# Altium schematic sheet M2RB.SchDoc
size B
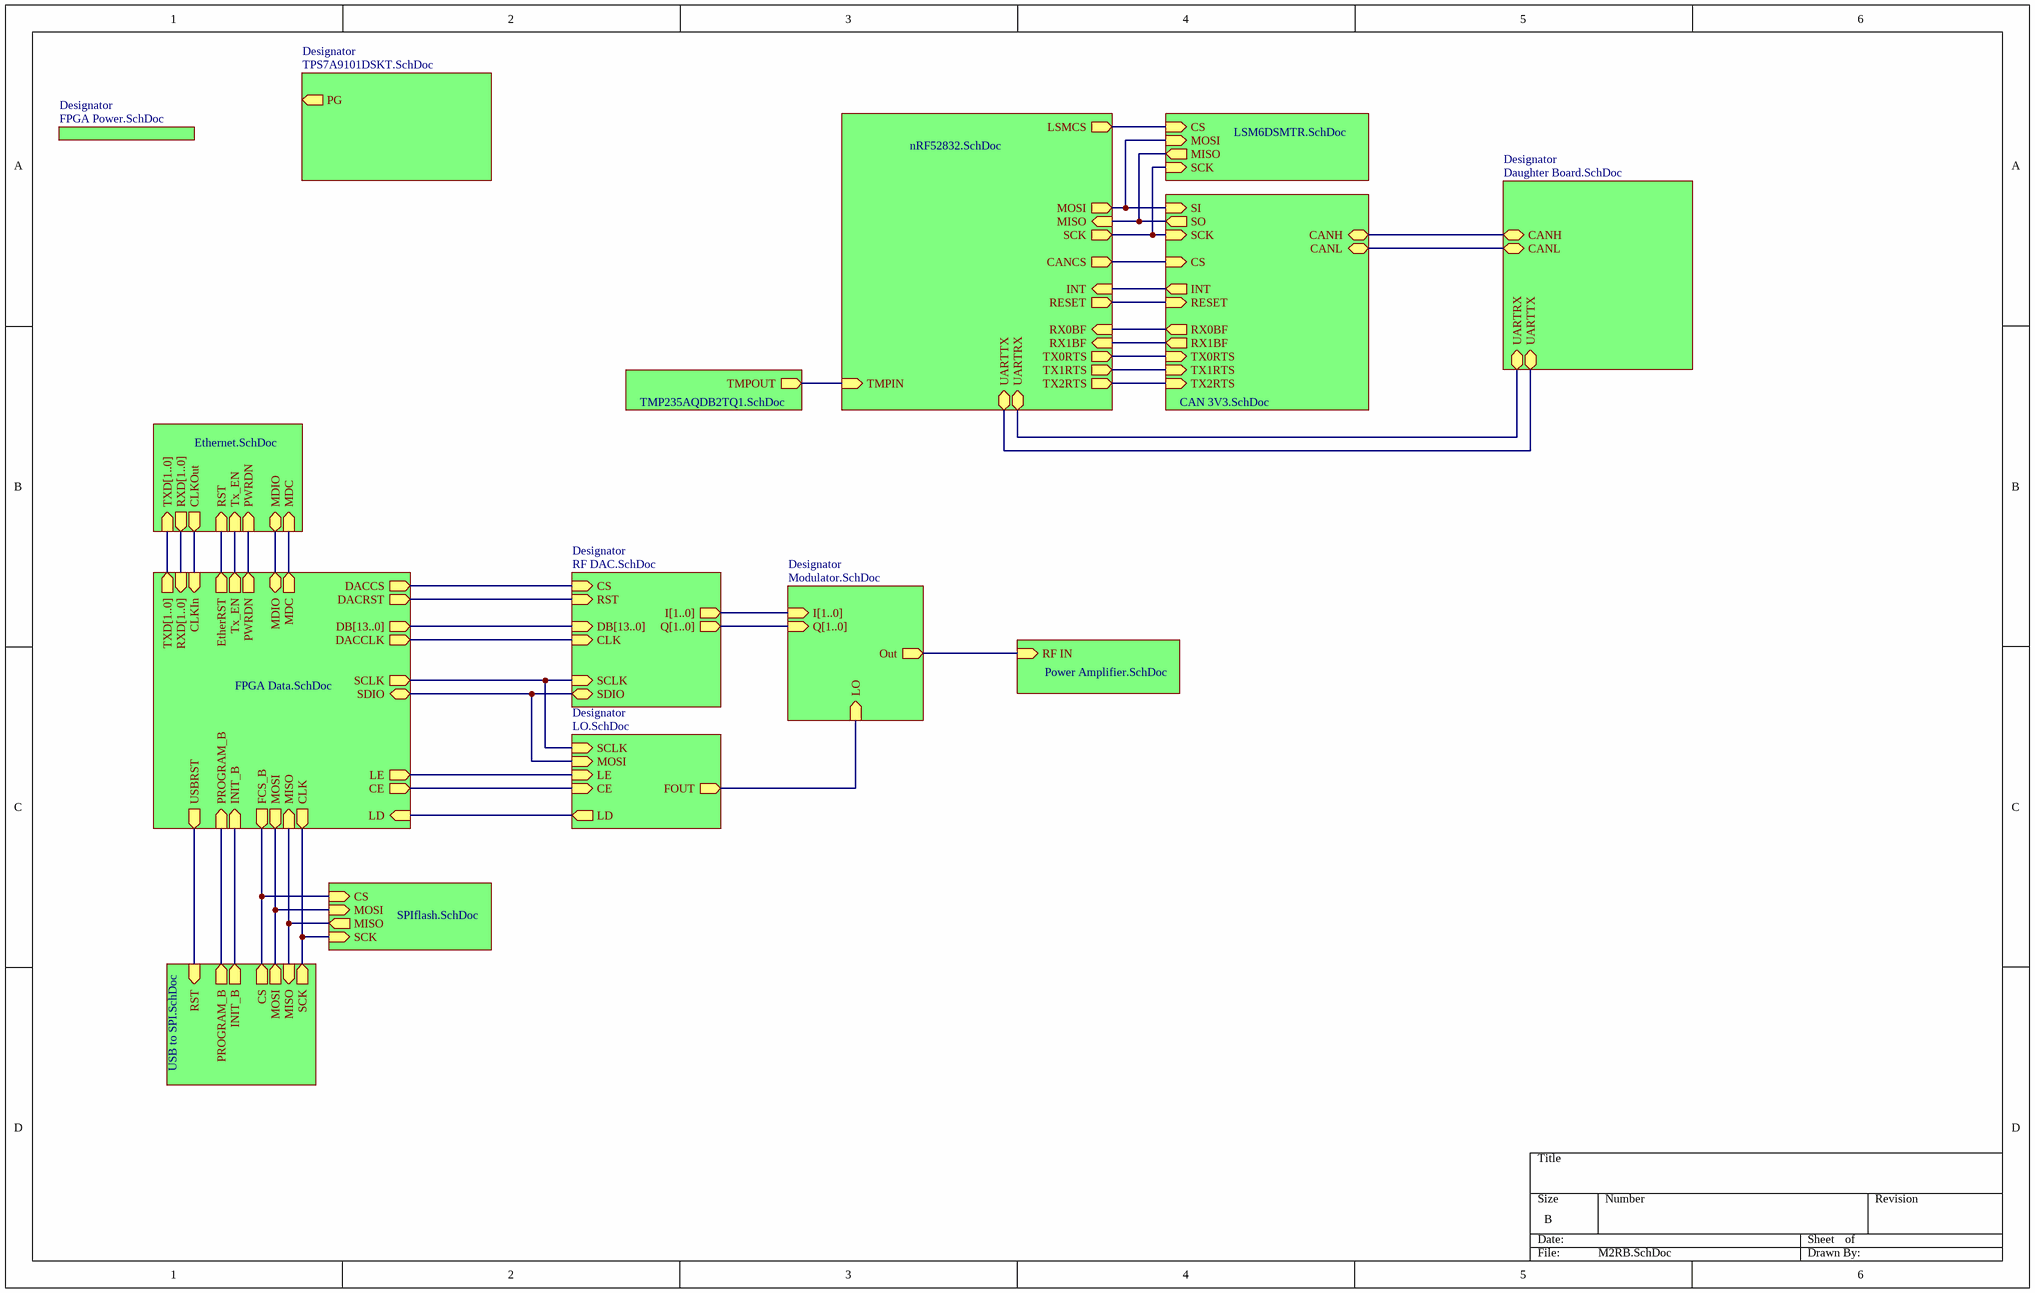
[diagram p0: M2RB.SchDoc]

## Sub-sheets
Designator = Power Amplifier.SchDoc: RF IN (in)
Designator = Daughter Board.SchDoc: UARTRX (bidir), UARTTX (bidir), CANL (bidir), CANH (bidir)
Designator = nRF52832.SchDoc: MOSI (out), MISO (in), TX0RTS (out), TX1RTS (out), RX1BF (in), SCK (out), RESET (out), RX0BF (in), TX2RTS (out), INT (in), CANCS (out), LSMCS (out), TMPIN (in), UARTRX (bidir), UARTTX (bidir)
Designator = FPGA Power.SchDoc: no entries
Designator = FPGA Data.SchDoc: CLK (out), PROGRAM_B (in), MOSI (out), FCS_B (out), INIT_B (in), MISO (in), RXD[1..0] (in), CLKIn (in), EtherRST (out), Tx_EN (out), MDC (out), PWRDN (out), MDIO (bidir), USBRST (out), TXD[1..0] (out), SCLK (out), SDIO (bidir), LE (out), CE (out), LD (in), DACCS (out), DACRST (out), DACCLK (out), DB[13..0] (out)
Designator = Ethernet.SchDoc: TXD[1..0] (in), RXD[1..0] (out), CLKOut (out), RST (in), Tx_EN (in), MDC (in), PWRDN (in), MDIO (bidir)
Designator = TPS7A9101DSKT.SchDoc: PG (out)
Designator = SPIflash.SchDoc: CS (in), MOSI (in), MISO (out), SCK (in)
Designator = USB to SPI.SchDoc: MISO (in), SCK (out), RST (in), PROGRAM_B (out), CS (out), MOSI (out), INIT_B (out)
Designator = CAN 3V3.SchDoc: SI (in), RX0BF (out), INT (out), RX1BF (out), TX2RTS (in), TX1RTS (in), TX0RTS (in), SO (out), RESET (in), CS (in), SCK (in), CANL (bidir), CANH (bidir)
Designator = LSM6DSMTR.SchDoc: MISO (out), CS (in), SCK (in), MOSI (in)
Designator = TMP235AQDB2TQ1.SchDoc: TMPOUT (out)
Designator = Modulator.SchDoc: I[1..0] (in), LO (in), Out (out), Q[1..0] (in)
Designator = RF DAC.SchDoc: CS (in), RST (in), Q[1..0] (out), SDIO (bidir), SCLK (in), DB[13..0] (in), CLK (in), I[1..0] (out)
Designator = LO.SchDoc: LE (in), MOSI (in), LD (out), CE (in), SCLK (in), FOUT (out)

## Nets
(unnamed): sheet Designator/RF IN, sheet Designator/Out
(unnamed): sheet Designator/UARTRX, sheet Designator/UARTRX
(unnamed): sheet Designator/UARTTX, sheet Designator/UARTTX
(unnamed): sheet Designator/CANL, sheet Designator/CANL
(unnamed): sheet Designator/CANH, sheet Designator/CANH
(unnamed): sheet Designator/MOSI, sheet Designator/SI, sheet Designator/MOSI
(unnamed): sheet Designator/MISO, sheet Designator/SO, sheet Designator/MISO
(unnamed): sheet Designator/TX0RTS, sheet Designator/TX0RTS
(unnamed): sheet Designator/TX1RTS, sheet Designator/TX1RTS
(unnamed): sheet Designator/RX1BF, sheet Designator/RX1BF
(unnamed): sheet Designator/SCK, sheet Designator/SCK, sheet Designator/SCK
(unnamed): sheet Designator/RESET, sheet Designator/RESET
(unnamed): sheet Designator/RX0BF, sheet Designator/RX0BF
(unnamed): sheet Designator/TX2RTS, sheet Designator/TX2RTS
(unnamed): sheet Designator/INT, sheet Designator/INT
(unnamed): sheet Designator/CANCS, sheet Designator/CS
(unnamed): sheet Designator/LSMCS, sheet Designator/CS
(unnamed): sheet Designator/TMPIN, sheet Designator/TMPOUT
(unnamed): sheet Designator/CLK, sheet Designator/SCK, sheet Designator/SCK
(unnamed): sheet Designator/PROGRAM_B, sheet Designator/PROGRAM_B
(unnamed): sheet Designator/MOSI, sheet Designator/MOSI, sheet Designator/MOSI
(unnamed): sheet Designator/FCS_B, sheet Designator/CS, sheet Designator/CS
(unnamed): sheet Designator/INIT_B, sheet Designator/INIT_B
(unnamed): sheet Designator/MISO, sheet Designator/MISO, sheet Designator/MISO
(unnamed): sheet Designator/CLKIn, sheet Designator/CLKOut
(unnamed): sheet Designator/EtherRST, sheet Designator/RST
(unnamed): sheet Designator/Tx_EN, sheet Designator/Tx_EN
(unnamed): sheet Designator/MDC, sheet Designator/MDC
(unnamed): sheet Designator/PWRDN, sheet Designator/PWRDN
(unnamed): sheet Designator/MDIO, sheet Designator/MDIO
(unnamed): sheet Designator/USBRST, sheet Designator/RST
(unnamed): sheet Designator/SCLK, sheet Designator/SCLK, sheet Designator/SCLK
(unnamed): sheet Designator/SDIO, sheet Designator/SDIO, sheet Designator/MOSI
(unnamed): sheet Designator/LE, sheet Designator/LE
(unnamed): sheet Designator/CE, sheet Designator/CE
(unnamed): sheet Designator/LD, sheet Designator/LD
(unnamed): sheet Designator/DACCS, sheet Designator/CS
(unnamed): sheet Designator/DACRST, sheet Designator/RST
(unnamed): sheet Designator/DACCLK, sheet Designator/CLK
(unnamed): sheet Designator/LO, sheet Designator/FOUT